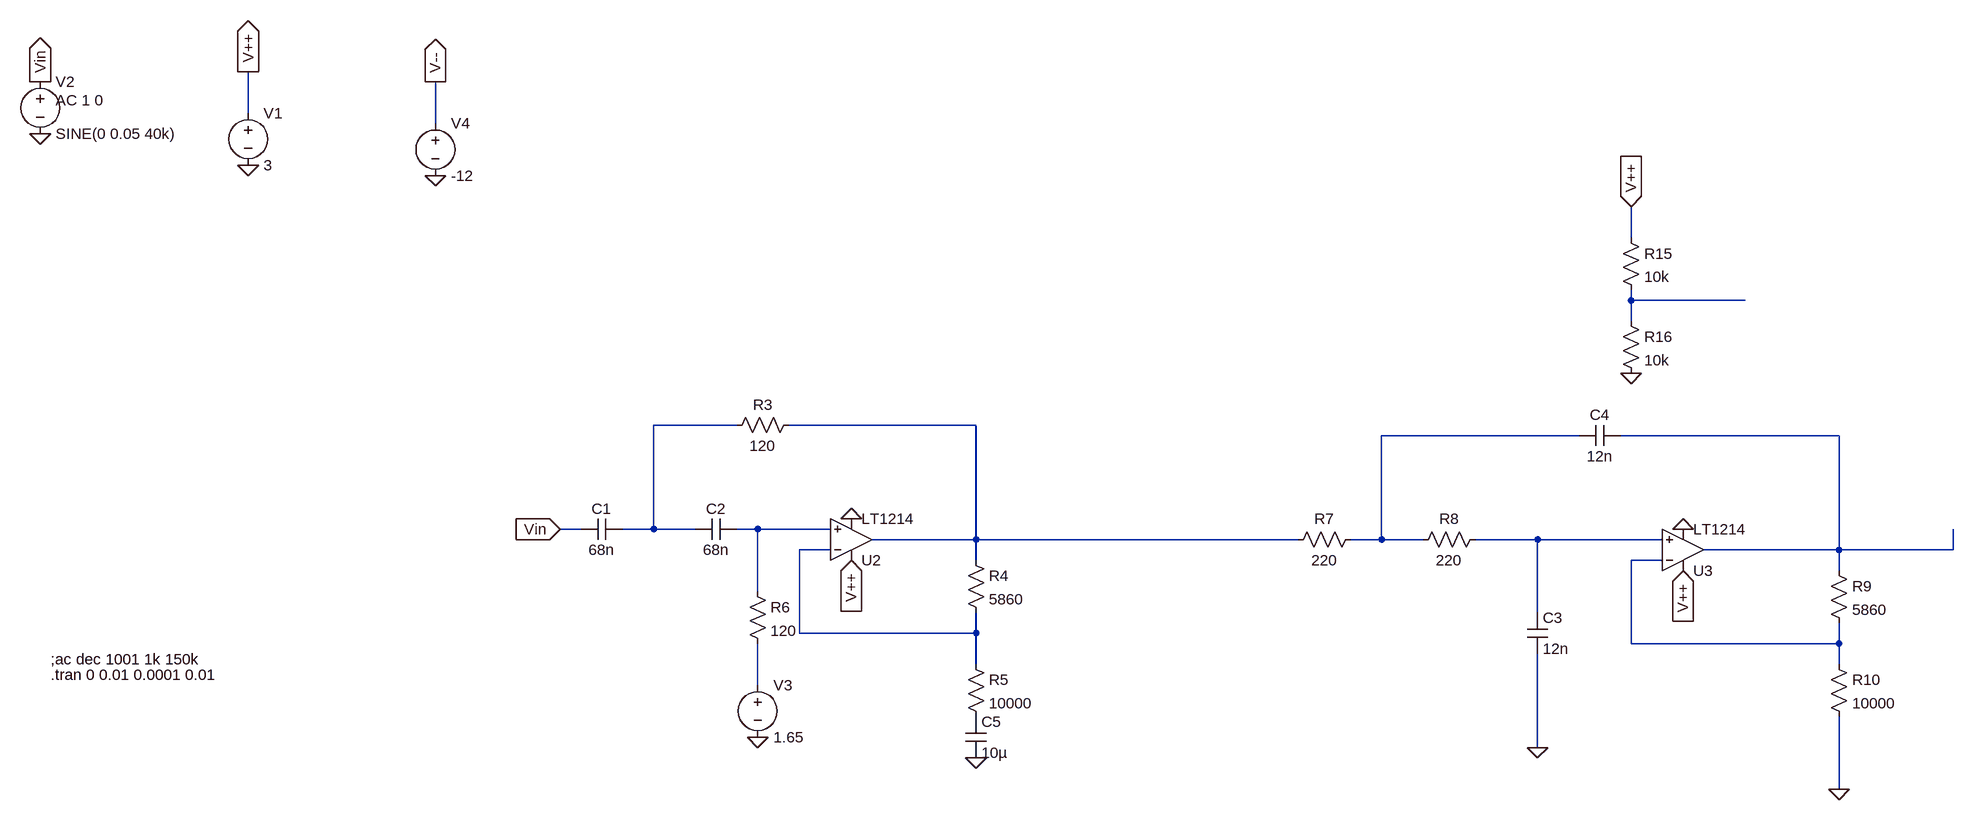
[diagram p0: schematic workingCascadeBias.asc]
workingCascadeBias.asc, the LTspice schematic file:
Version 4
SHEET 1 2132 884
WIRE -512 -640 -512 -704
WIRE -224 -624 -224 -688
WIRE 1616 -448 1616 -496
WIRE 1616 -352 1616 -368
WIRE 1792 -352 1616 -352
WIRE 1616 -320 1616 -352
WIRE 240 -160 112 -160
WIRE 608 -160 320 -160
WIRE 1536 -144 1232 -144
WIRE 1936 -144 1600 -144
WIRE 0 0 -32 0
WIRE 112 0 112 -160
WIRE 112 0 64 0
WIRE 176 0 112 0
WIRE 272 0 240 0
WIRE 384 0 272 0
WIRE 608 16 608 -160
WIRE 608 16 448 16
WIRE 1104 16 608 16
WIRE 1232 16 1232 -144
WIRE 1232 16 1184 16
WIRE 1296 16 1232 16
WIRE 1472 16 1376 16
WIRE 1664 16 1472 16
WIRE 384 32 336 32
WIRE 1936 32 1936 -144
WIRE 1936 32 1728 32
WIRE 2112 32 2112 0
WIRE 2112 32 1936 32
WIRE 608 48 608 16
WIRE 1664 48 1616 48
WIRE 1936 64 1936 32
WIRE 272 96 272 0
WIRE 1472 128 1472 16
WIRE 336 160 336 32
WIRE 608 160 608 128
WIRE 608 160 336 160
WIRE 1616 176 1616 48
WIRE 1936 176 1936 144
WIRE 1936 176 1616 176
WIRE 608 208 608 160
WIRE 1936 208 1936 176
WIRE 272 240 272 176
WIRE 1472 336 1472 192
WIRE 1936 400 1936 288
FLAG -32 0 Vin
IOPIN -32 0 In
FLAG -512 -560 0
FLAG -512 -704 V++
IOPIN -512 -704 Out
FLAG -832 -608 0
FLAG -832 -688 Vin
IOPIN -832 -688 Out
FLAG 1616 -496 V++
IOPIN 1616 -496 In
FLAG 1616 -240 0
FLAG 1936 400 0
FLAG 1696 64 V++
IOPIN 1696 64 In
FLAG 416 48 V++
IOPIN 416 48 In
FLAG 1472 336 0
FLAG -224 -544 0
FLAG -224 -688 V--
IOPIN -224 -688 Out
FLAG 1696 0 0
FLAG 272 320 0
FLAG 416 -16 0
FLAG 608 352 0
SYMBOL cap 64 -16 R90
WINDOW 0 0 32 VBottom 2
WINDOW 3 32 32 VTop 2
SYMATTR InstName C1
SYMATTR Value 68n
SYMBOL cap 240 -16 R90
WINDOW 0 0 32 VBottom 2
WINDOW 3 32 32 VTop 2
SYMATTR InstName C2
SYMATTR Value 68n
SYMBOL Opamps\\LT1214 416 80 M180
SYMATTR InstName U2
SYMBOL res 336 -176 R90
WINDOW 0 0 56 VBottom 2
WINDOW 3 32 56 VTop 2
SYMATTR InstName R3
SYMATTR Value 120
SYMBOL res 592 32 R0
SYMATTR InstName R4
SYMATTR Value 5860
SYMBOL res 592 192 R0
SYMATTR InstName R5
SYMATTR Value 10000
SYMBOL res 256 80 R0
SYMATTR InstName R6
SYMATTR Value 120
SYMBOL res 1392 0 R90
WINDOW 0 0 56 VBottom 2
WINDOW 3 32 56 VTop 2
SYMATTR InstName R8
SYMATTR Value 220
SYMBOL cap 1456 128 R0
SYMATTR InstName C3
SYMATTR Value 12n
SYMBOL cap 1600 -160 R90
WINDOW 0 0 32 VBottom 2
WINDOW 3 32 32 VTop 2
SYMATTR InstName C4
SYMATTR Value 12n
SYMBOL Opamps\\LT1214 1696 96 M180
SYMATTR InstName U3
SYMBOL res 1920 48 R0
SYMATTR InstName R9
SYMATTR Value 5860
SYMBOL res 1920 192 R0
SYMATTR InstName R10
SYMATTR Value 10000
SYMBOL voltage -512 -656 R0
WINDOW 123 0 0 Left 0
WINDOW 39 0 0 Left 0
SYMATTR InstName V1
SYMATTR Value 3
SYMBOL voltage -832 -704 R0
WINDOW 123 24 44 Left 2
WINDOW 39 0 0 Left 0
SYMATTR Value2 AC 1 0
SYMATTR InstName V2
SYMATTR Value SINE(0 0.05 40k)
SYMBOL res 1600 -464 R0
SYMATTR InstName R15
SYMATTR Value 10k
SYMBOL res 1600 -336 R0
SYMATTR InstName R16
SYMATTR Value 10k
SYMBOL voltage -224 -640 R0
WINDOW 123 0 0 Left 0
WINDOW 39 0 0 Left 0
SYMATTR InstName V4
SYMATTR Value -12
SYMBOL voltage 272 224 R0
WINDOW 123 0 0 Left 0
WINDOW 39 0 0 Left 0
SYMATTR InstName V3
SYMATTR Value 1.65
SYMBOL res 1200 0 R90
WINDOW 0 0 56 VBottom 2
WINDOW 3 32 56 VTop 2
SYMATTR InstName R7
SYMATTR Value 220
SYMBOL cap 592 288 R0
SYMATTR InstName C5
SYMATTR Value 10µ
TEXT -816 200 Left 2 !;ac dec 1001 1k 150k
TEXT -816 224 Left 2 !.tran 0 0.01 0.0001 0.01

The netlist it stands for:
* workingCascadeBias.asc
C1 N002 Vin 68n
C2 N006 N002 68n
XU2 N006 N008 V++ 0 N003 LT1213  ; LT1214, pins In+ In- V+ V- OUT
R3 N003 N002 120
R4 N003 N008 5860
R5 N008 P001 10000
R6 N006 N010 120
R8 N007 N004 220
C3 N007 0 12n
C4 N005 N004 12n
XU3 N007 N009 V++ 0 N005 LT1213  ; LT1214, pins In+ In- V+ V- OUT
R9 N005 N009 5860
R10 N009 0 10000
V1 V++ 0 3
V2 Vin 0 SINE(0 0.05 40k) AC 1 0
R15 V++ N001 10k
R16 N001 0 10k
V4 V-- 0 -12
V3 N010 0 1.65
R7 N004 N003 220
C5 P001 0 10µ
;ac dec 1001 1k 150k
.tran 0 0.01 0.0001 0.01
.lib LTC.lib
.backanno
.end